# EAGLE schematic AS5048 Encoder (EAGLE 6.6.0)
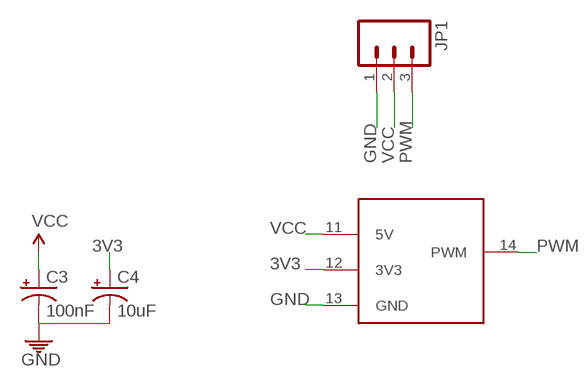
[diagram p0: schematic, sheet 1]

## Parts
C3  100nF  CAP_POL1206-KIT  [EIA3216-KIT]
C4  10uF  CAP_POL1206-KIT  [EIA3216-KIT]
JP1  M03LOCK  [1X03_LOCK]
U$1  AS5048  [TSOP14]

## Nets
3V3: C4.A(+) U$1.12(3V3)
GND: C3.C(-) C4.C(-) JP1.1 U$1.13(GND)
PWM: JP1.3 U$1.14(PWM)
VCC: C3.A(+) JP1.2 U$1.11(5V)

## Library data of the parts
C3 C4 = SparkFun-Passives:CAP_POL: Capacitor Polarized These are standard SMD and PTH capacitors. Normally 10uF, 47uF, and 100uF in electrolytic and tantalum varieties. Always verify the external diameter of the through hole cap, it varies with capacity, voltage, and manufacturer. The EIA devices should be standard.
JP1 = SparkFun-Connectors:M03: Header 3 Standard 3-pin 0.1" header. Use with straight break away headers (SKU : PRT-00116), right angle break away headers (PRT-00553), swiss pins (PRT-00743), machine pins (PRT-00117), and female headers (PRT-00115). Molex polarized connector foot print use with SKU : PRT-08232 with associated crimp pins and housings.
U$1 = austriamicrosystems:AS5048